# EAGLE design RUMP (EAGLE 6.4)
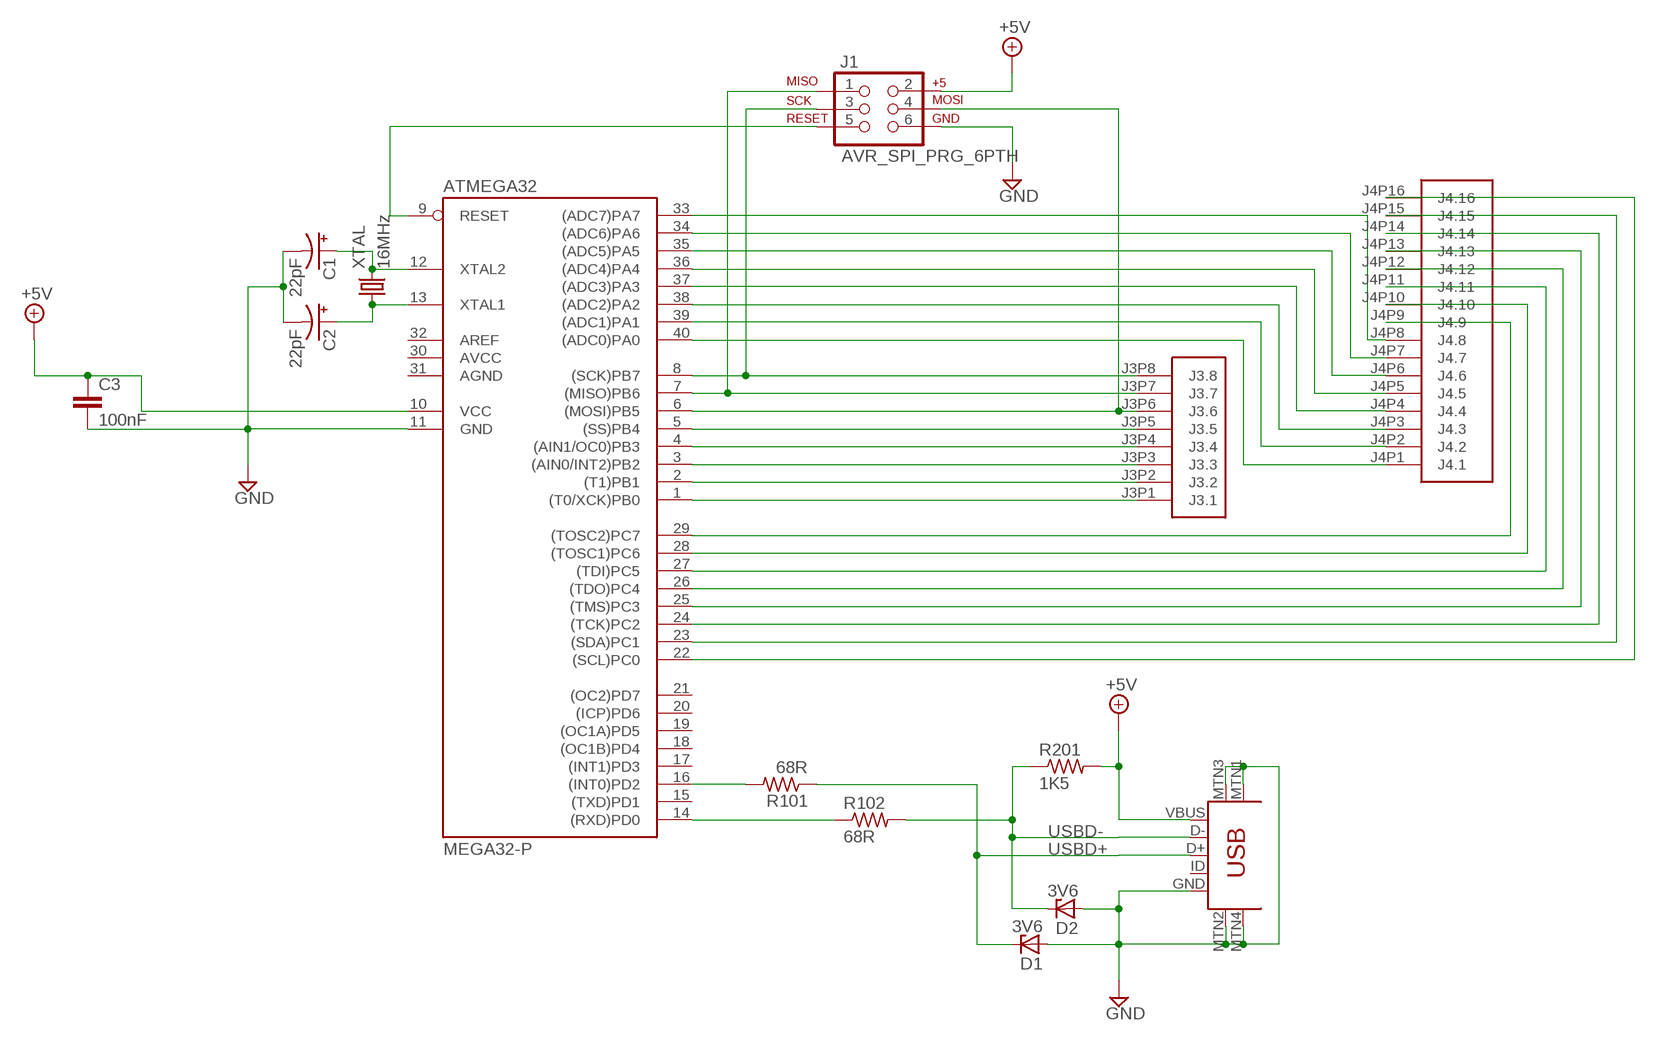
[diagram p0: schematic, sheet 1]

## Parts
ATMEGA32  MEGA32-P  [DIL40]
C1  22pF  CPOL-USE2-4  [E2-4]
C2  22pF  CPOL-USE2-4  [E2-4]
C3  100nF  C2.5/2  [C2.5-2]
D1  3V6  ZENER-DIODEDO35Z10  [DO35Z10]
D2  3V6  ZENER-DIODEDO35Z10  [DO35Z10]
J1  AVR_SPI_PRG_6PTH  [2X3]
R101  68R  R-US_0204/7  [0204/7]
R102  68R  R-US_0204/7  [0204/7]
R201  1K5  R-US_0204/7  [0204/7]
U$1  MODEL-M-J3  [MODEL-M-J3]
U$2  MODEL-M-J4  [MODEL-M-J4]
U$3  USB-MINIB-5PIN  [USB-MINIB]
XTAL  16MHz  CRYSTALHC49S  [HC49/S]

## Nets
+5V: ATMEGA32.10(VCC) C3.1 J1.2 R201.2 U$3.VBUS
GND: ATMEGA32.11(GND) C1.- C2.- C3.2 D1.A D2.A J1.6 U$3.GND U$3.MTN1(MTN2) U$3.MTN2(MTN3) U$3.MTN3(MTN1) U$3.MTN4
N$1: ATMEGA32.14((RXD)PD0) R102.1
N$2: ATMEGA32.16((INT0)PD2) R101.2
N$3: ATMEGA32.1((T0/XCK)PB0) U$1.J3P1(J3.1)
N$4: ATMEGA32.2((T1)PB1) U$1.J3P2(J3.2)
N$5: ATMEGA32.3((AIN0/INT2)PB2) U$1.J3P3(J3.3)
N$6: ATMEGA32.4((AIN1/OC0)PB3) U$1.J3P4(J3.4)
N$8: ATMEGA32.5((SS)PB4) U$1.J3P5(J3.5)
N$9: ATMEGA32.6((MOSI)PB5) J1.4 U$1.J3P6(J3.6)
N$10: ATMEGA32.7((MISO)PB6) J1.1 U$1.J3P7(J3.7)
N$11: ATMEGA32.8((SCK)PB7) J1.3 U$1.J3P8(J3.8)
N$12: ATMEGA32.40((ADC0)PA0) U$2.J4P1(J4.1)
N$13: ATMEGA32.39((ADC1)PA1) U$2.J4P2(J4.2)
N$14: ATMEGA32.38((ADC2)PA2) U$2.J4P3(J4.3)
N$15: ATMEGA32.37((ADC3)PA3) U$2.J4P4(J4.4)
N$16: ATMEGA32.36((ADC4)PA4) U$2.J4P5(J4.5)
N$17: ATMEGA32.35((ADC5)PA5) U$2.J4P6(J4.6)
N$18: ATMEGA32.34((ADC6)PA6) U$2.J4P7(J4.7)
N$19: ATMEGA32.33((ADC7)PA7) U$2.J4P8(J4.8)
N$20: ATMEGA32.12(XTAL2) C1.+ XTAL.2
N$21: ATMEGA32.13(XTAL1) C2.+ XTAL.1
N$28: ATMEGA32.29((TOSC2)PC7) U$2.J4P9(J4.9)
N$29: ATMEGA32.28((TOSC1)PC6) U$2.J4P10(J4.10)
N$30: ATMEGA32.27((TDI)PC5) U$2.J4P11(J4.11)
N$31: ATMEGA32.26((TDO)PC4) U$2.J4P12(J4.12)
N$32: ATMEGA32.25((TMS)PC3) U$2.J4P13(J4.13)
N$33: ATMEGA32.24((TCK)PC2) U$2.J4P14(J4.14)
N$34: ATMEGA32.23((SDA)PC1) U$2.J4P15(J4.15)
N$35: ATMEGA32.22((SCL)PC0) U$2.J4P16(J4.16)
RESET: ATMEGA32.9(RESET) J1.5
USBD+: D1.C R101.1 U$3.D+
USBD-: D2.C R102.2 R201.1 U$3.D-
Unconnected: ATMEGA32.15((TXD)PD1) ATMEGA32.17((INT1)PD3) ATMEGA32.18((OC1B)PD4) ATMEGA32.19((OC1A)PD5) ATMEGA32.20((ICP)PD6) ATMEGA32.21((OC2)PD7) ATMEGA32.32(AREF) U$3.ID

## Power pins joined to a net without a drawn wire
AGND: ATMEGA32.31(AGND)
AVCC: ATMEGA32.30(AVCC)

## Library data of the parts
ATMEGA32 = atmel:MEGA32-P: MICROCONTROLLER 32 Kbytes FLASH 2 Kbytes SRAM 1 Kbytes EEPROM USART 8-channel 10 bit ADC Source: www.atmel.com .. doc2503.pdf
C1 C2 = resistor:CPOL-US: POLARIZED CAPACITOR, American symbol
C3 = capacitor-wima:C: CAPACITOR naming: grid - package width
D1 D2 = diode:ZENER-DIODE: Z-Diode
J1 = SparkFun-Connectors:AVR_SPI_PRG_6: AVR ISP 6 Pin This is the reduced ISP connector for AVR programming. Common on Arduino. This footprint will take up less PCB space and can be used with a 10-pin to 6-pin adapter such as SKU: BOB-08508
R101 R102 R201 = resistor:R-US_: RESISTOR, American symbol
U$1 = MODEL-M:MODEL-M-J3
U$2 = MODEL-M:MODEL-M-J4
U$3 = SparkFun-Connectors:USB-MINIB: Mini-USB "B" connector with 5th pin broken out. Created new symbol breaking out 5th "ID" pin in mini/micro USB connector spec. See: http://en.wikipedia.org/wiki/Mini_usb#Cables. Uses same footprint as 4-pin symbol. Also added pins to connect to mounting / shield pads if required (probably not generally needed as signals aren't shielded once they leave the connector).
XTAL = crystal:CRYSTAL: CRYSTAL

## Board
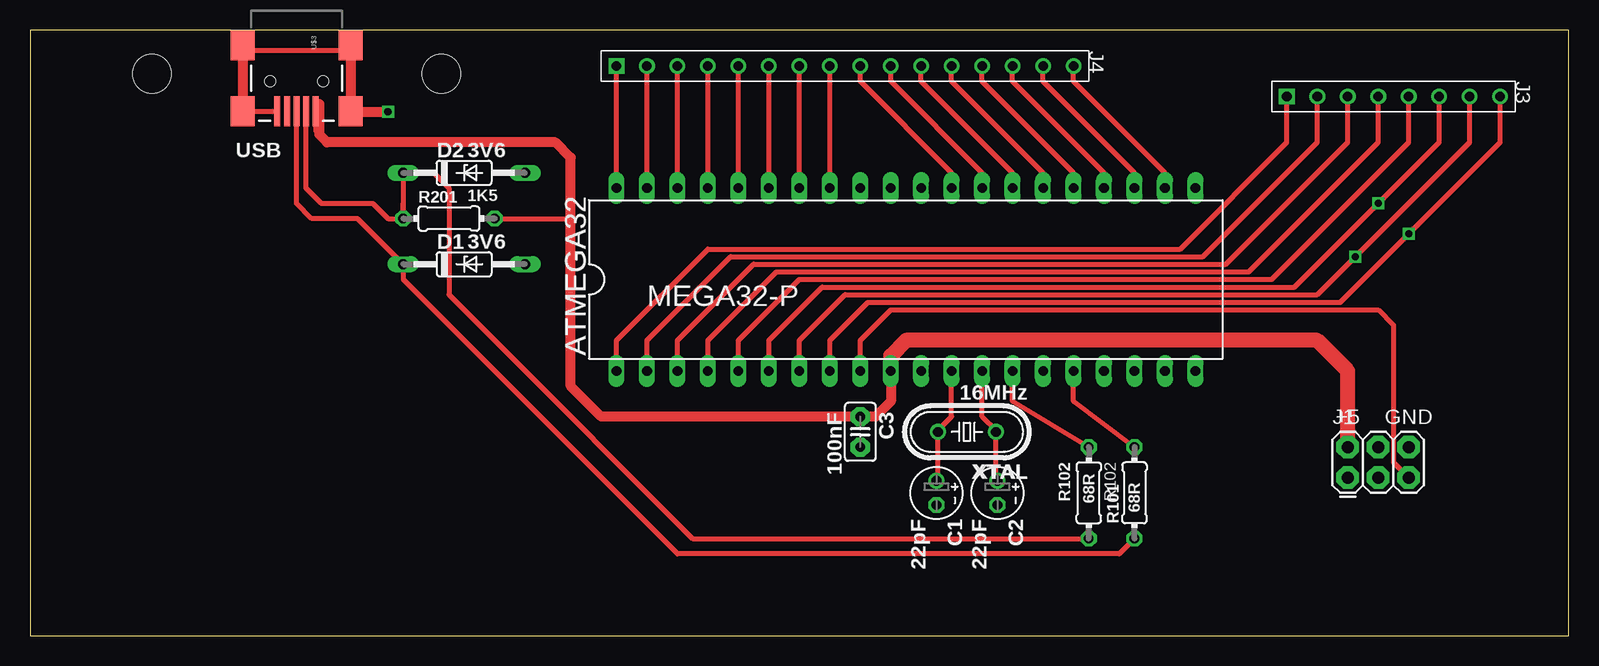
[diagram p1: board, top side]
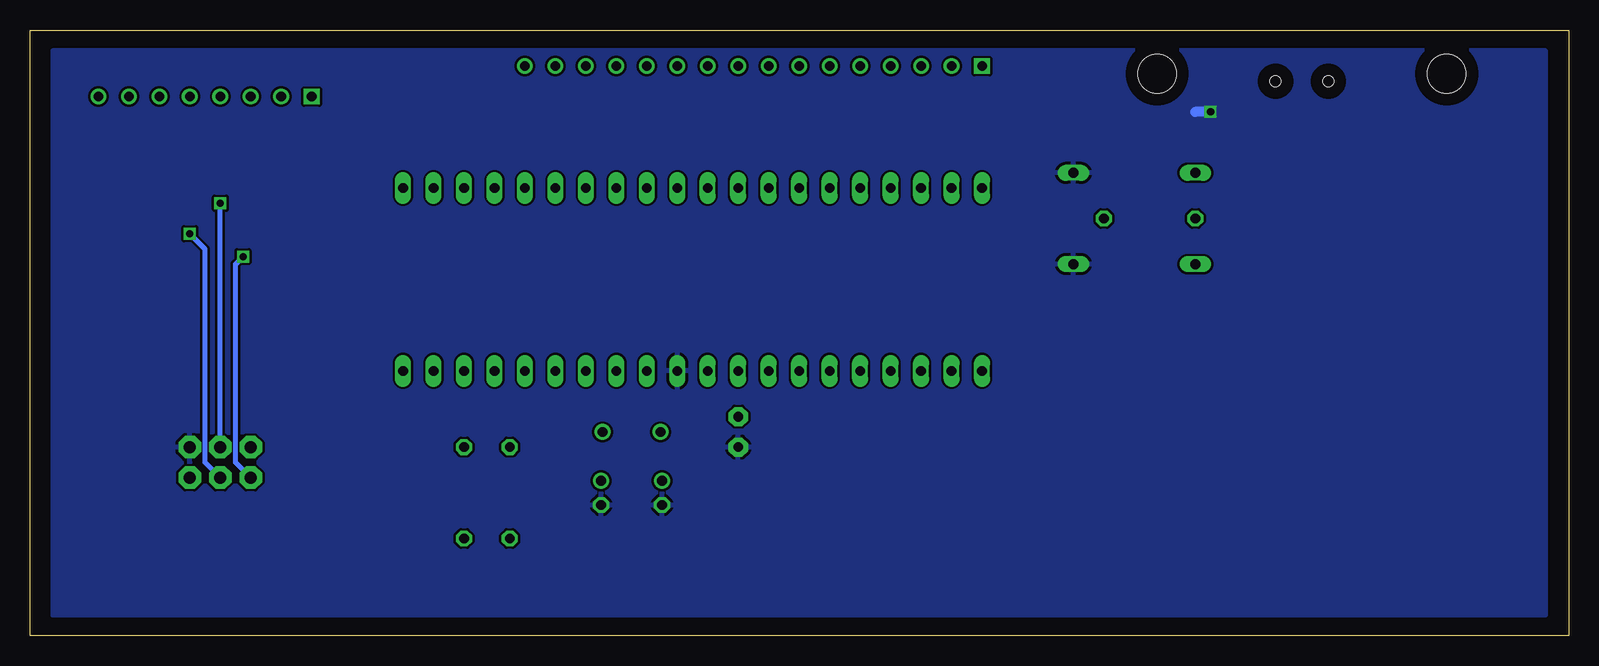
[diagram p2: board, bottom side, seen from below]

Size 128.25 x 50.47 mm. Coordinates in mm from the lower left corner, seen from the top.
Outline: 0,0 128.25,0 128.25,50.47 0,50.47 0,0
Copper layers (1*16): Top 0.035mm / dielectric 1.5mm / Bottom 0.035mm
Design rules "default": minimum track width 10mil, minimum drill 24mil, track to track 8mil, track to pad 8mil, pad to pad 8mil, via to via 8mil, smd to smd 8mil, copper to edge 40mil, drill to drill 8mil, minimum pad ring 10mil, minimum via ring 8mil, stop-mask expansion 4mil, vias tented up to drill 0mil, thermal gap 10mil
Holes 3.2 mm at 10.15,46.83 34.28,46.83

### Footprints (pad centres in the part's own frame; a part is rotated, then mirrored left to right if it is on the bottom)
DIL40 = drill 0.813 long: 1 -24.13,-7.62; 2 -21.59,-7.62; 3 -19.05,-7.62; 4 -16.51,-7.62; 5 -13.97,-7.62; 6 -11.43,-7.62; 7 -8.89,-7.62; 8 -6.35,-7.62; 9 -3.81,-7.62; 10 -1.27,-7.62; 11 1.27,-7.62; 12 3.81,-7.62; 13 6.35,-7.62; 14 8.89,-7.62; 15 11.43,-7.62; 16 13.97,-7.62; 17 16.51,-7.62; 18 19.05,-7.62; 19 21.59,-7.62; 20 24.13,-7.62; 21 24.13,7.62; 22 21.59,7.62; 23 19.05,7.62; 24 16.51,7.62; 25 13.97,7.62; 26 11.43,7.62; 27 8.89,7.62; 28 6.35,7.62; 29 3.81,7.62; 30 1.27,7.62; 31 -1.27,7.62; 32 -3.81,7.62; 33 -6.35,7.62; 34 -8.89,7.62; 35 -11.43,7.62; 36 -13.97,7.62; 37 -16.51,7.62; 38 -19.05,7.62; 39 -21.59,7.62; 40 -24.13,7.62
E2-4 = drill 0.813 pad 1.27: + -1.016,0 | drill 0.813 pad 1.27 octagon: - 1.016,0
C2.5-2 = drill 0.813 pad 1.6 octagon: 1 -1.27,0; 2 1.27,0
DO35Z10 = drill 0.813 long: A 5.08,0; C -5.08,0
2X3 = drill 1.016 pad 1.88 octagon: 1 0,0; 2 0,2.54; 3 2.54,0; 4 2.54,2.54; 5 5.08,0; 6 5.08,2.54
0204/7 = drill 0.813 octagon: 1 -3.81,0; 2 3.81,0
MODEL-M-J3 = drill 0.8 square: J3P1 -8.89,0 | drill 0.8: J3P2 -6.35,0; J3P3 -3.81,0; J3P4 -1.27,0; J3P5 1.27,0; J3P6 3.81,0; J3P7 6.35,0; J3P8 8.89,0
MODEL-M-J4 = drill 0.8 square: J4P1 -19.05,0 | drill 0.8: J4P2 -16.51,0; J4P3 -13.97,0; J4P4 -11.43,0; J4P5 -8.89,0; J4P6 -6.35,0; J4P7 -3.81,0; J4P8 -1.27,0; J4P9 1.27,0; J4P10 3.81,0; J4P11 6.35,0; J4P12 8.89,0; J4P13 11.43,0; J4P14 13.97,0; J4P15 16.51,0; J4P16 19.05,0
USB-MINIB = smd 2.5 x 0.5: D+ 2.5,0; D- 2.5,0.8; GND 2.5,-1.6; ID 2.5,-0.8; VBUS 2.5,1.6 | smd 2.5 x 2: MTN1 -3,4.5; MTN2 2.5,4.5; MTN3 -3,-4.5; MTN4 2.5,-4.5 | hole 0.9: 0,2.2; 0,-2.2
HC49/S = drill 0.813: 1 -2.413,0; 2 2.413,0

### Placement (x,y rotation side)
ATMEGA32  73.02,29.68 0 top
C1  75.56,11.9 270 top
C2  80.64,11.9 270 top
C3  69.21,16.98 270 top
D1  36.19,30.95 0 top
D2  36.19,38.57 0 top
J1  109.85,13.17 0 top
R101  92.07,11.9 90 top
R102  88.26,11.9 270 top
R201  34.92,34.76 0 top
U$1  113.66,44.92 0 top
U$2  67.94,47.46 0 top
U$3  22.22,46.19 270 top
XTAL  78.1,16.98 180 top

### Tracks (layer width: path | path; a pad name or v marks a point on that pad's centre or on a via)
+5V
  Top 0.406: U$3.VBUS 23.82,42.05 24.76,41.11 43.81,41.11 45.08,39.84 45.08,34.76 | 45.08,34.76 45.08,20.79 46.35,19.52 47.62,18.25 C3.1 | C3.1 70.48,18.25 | 70.48,18.25 71.75,19.52 ATMEGA32.10 | R201.2 45.08,34.76 | C3.1 70.48,18.25
  Top 0.813: ATMEGA32.10 71.75,19.52 70.48,18.25 C3.1 47.62,18.25 45.08,20.79 45.08,34.76 45.08,39.84 43.81,41.11 24.76,41.11 24.12,41.75 24.12,44.29
  Top 1.27: J1.2 109.85,22.06 107.31,24.6 73.02,24.6 71.75,23.33 ATMEGA32.10
GND  (via drill 0.6)
  Top 0.406: U$3.MTN4 U$3.GND | U$3.MTN2 26.66,43.75 26.66,48.73 17.77,48.73 17.72,48.79 U$3.MTN3
  Top 0.813: U$3.MTN3 U$3.MTN4 | U$3.MTN1 U$3.MTN2 26.76,43.65 v29.84,43.65
  Bottom 0.813: v29.84,43.65 31.11,43.65
  pour Bottom: 1.9,48.73 126.36,48.73 126.36,1.74 1.9,1.74
N$1
  Top 0.406: ATMEGA32.14 81.91,19.52 R102.1
N$2
  Top 0.406: ATMEGA32.16 86.99,19.52 R101.2
N$3
  Top 0.406: ATMEGA32.1 48.89,24.6 56.51,32.22 95.88,32.22 104.77,41.11 U$1.J3P1
N$4
  Top 0.406: ATMEGA32.2 51.43,24.6 58.41,31.58 97.78,31.58 107.31,41.11 U$1.J3P2
N$5
  Top 0.406: ATMEGA32.3 53.97,24.6 60.32,30.95 99.69,30.95 109.85,41.11 U$1.J3P3
N$6
  Top 0.406: ATMEGA32.4 56.51,24.6 62.23,30.31 101.59,30.31 112.39,41.11 U$1.J3P4
N$8
  Top 0.406: ATMEGA32.5 59.05,24.6 64.13,29.68 103.5,29.68 114.93,41.11 U$1.J3P5
N$9  (via drill 0.6)
  Top 0.406: ATMEGA32.6 61.59,24.6 66.03,29.04 105.41,29.04 v112.39,36.03 117.47,41.11 U$1.J3P6
  Bottom 0.406: J1.4 v112.39,36.03
N$10  (via drill 0.6)
  Top 0.406: ATMEGA32.7 64.13,24.6 67.94,28.41 107.31,28.41 109.22,30.31 | U$1.J3P7 120.01,41.11 v110.48,31.58 | 109.22,30.31 v110.48,31.58 | v110.48,31.58 109.22,30.31
  Bottom 0.406: J1.1 111.12,14.44 111.12,30.95 v110.48,31.58
N$11  (via drill 0.6)
  Top 0.406: ATMEGA32.8 66.67,24.6 69.84,27.77 109.22,27.77 v114.93,33.49 | v114.93,33.49 116.2,34.76 | 116.2,34.76 122.55,41.11 U$1.J3P8 | v114.93,33.49 116.2,34.76
  Bottom 0.406: J1.3 113.66,14.44 113.66,32.22 v114.93,33.49
N$12
  Top 0.406: ATMEGA32.40 U$2.J4P1
N$13
  Top 0.406: ATMEGA32.39 U$2.J4P2
N$14
  Top 0.406: ATMEGA32.38 U$2.J4P3
N$15
  Top 0.406: ATMEGA32.37 U$2.J4P4
N$16
  Top 0.406: ATMEGA32.36 U$2.J4P5
N$17
  Top 0.406: ATMEGA32.35 U$2.J4P6
N$18
  Top 0.406: ATMEGA32.34 U$2.J4P7
N$19
  Top 0.406: ATMEGA32.33 U$2.J4P8
N$20
  Top 0.406: ATMEGA32.12 76.83,18.25 75.69,17.11 XTAL.2 75.69,13.3 75.56,13.17 C1.+
N$21
  Top 0.406: ATMEGA32.13 79.37,18.25 80.64,16.98 XTAL.1 80.51,13.3 80.64,13.17 C2.+
N$28
  Top 0.406: U$2.J4P9 69.21,46.19 76.83,38.57 ATMEGA32.29
N$29
  Top 0.406: ATMEGA32.28 79.37,38.57 71.75,46.19 U$2.J4P10
N$30
  Top 0.406: U$2.J4P11 74.29,46.19 81.91,38.57 ATMEGA32.27
N$31
  Top 0.406: U$2.J4P12 76.83,46.19 84.45,38.57 ATMEGA32.26
N$32
  Top 0.406: ATMEGA32.25 86.99,38.57 79.37,46.19 U$2.J4P13
N$33
  Top 0.406: U$2.J4P14 81.91,46.19 89.53,38.57 ATMEGA32.24
N$34
  Top 0.406: ATMEGA32.23 92.07,38.57 84.45,46.19 U$2.J4P15
N$35
  Top 0.406: U$2.J4P16 86.99,46.19 94.61,38.57 ATMEGA32.22
RESET
  Top 0.406: ATMEGA32.9 69.21,24.6 71.75,27.14 112.39,27.14 113.66,25.87 113.66,14.44 J1.5
USBD+
  Top 0.406: U$3.D+ 22.22,36.03 23.49,34.76 27.3,34.76 D1.C 31.11,29.68 53.97,6.82 90.8,6.82 R101.1
USBD-
  Top 0.406: R102.2 55.24,8.09 38.73,24.6 34.92,28.41 34.92,37.3 33.65,38.57 D2.C 31.11,36.03 | 31.11,36.03 R201.1 | R201.1 31.11,36.03 | U$3.D- 23.02,37.3 24.29,36.03 28.57,36.03 29.84,34.76 R201.1

### Text on the board
tPlace: +5 | GND
_tsilk: USB | D2 | 3V6 | R201 | 1K5 | D1 | 3V6 | MEGA32-P | ATMEGA32 | 16MHz | 100nF | C3 | XTAL | R102 | 68R | 22pF | C1 | 22pF | C2 | 68R | R101